# EAGLE design battery_display (EAGLE 7.3.0)
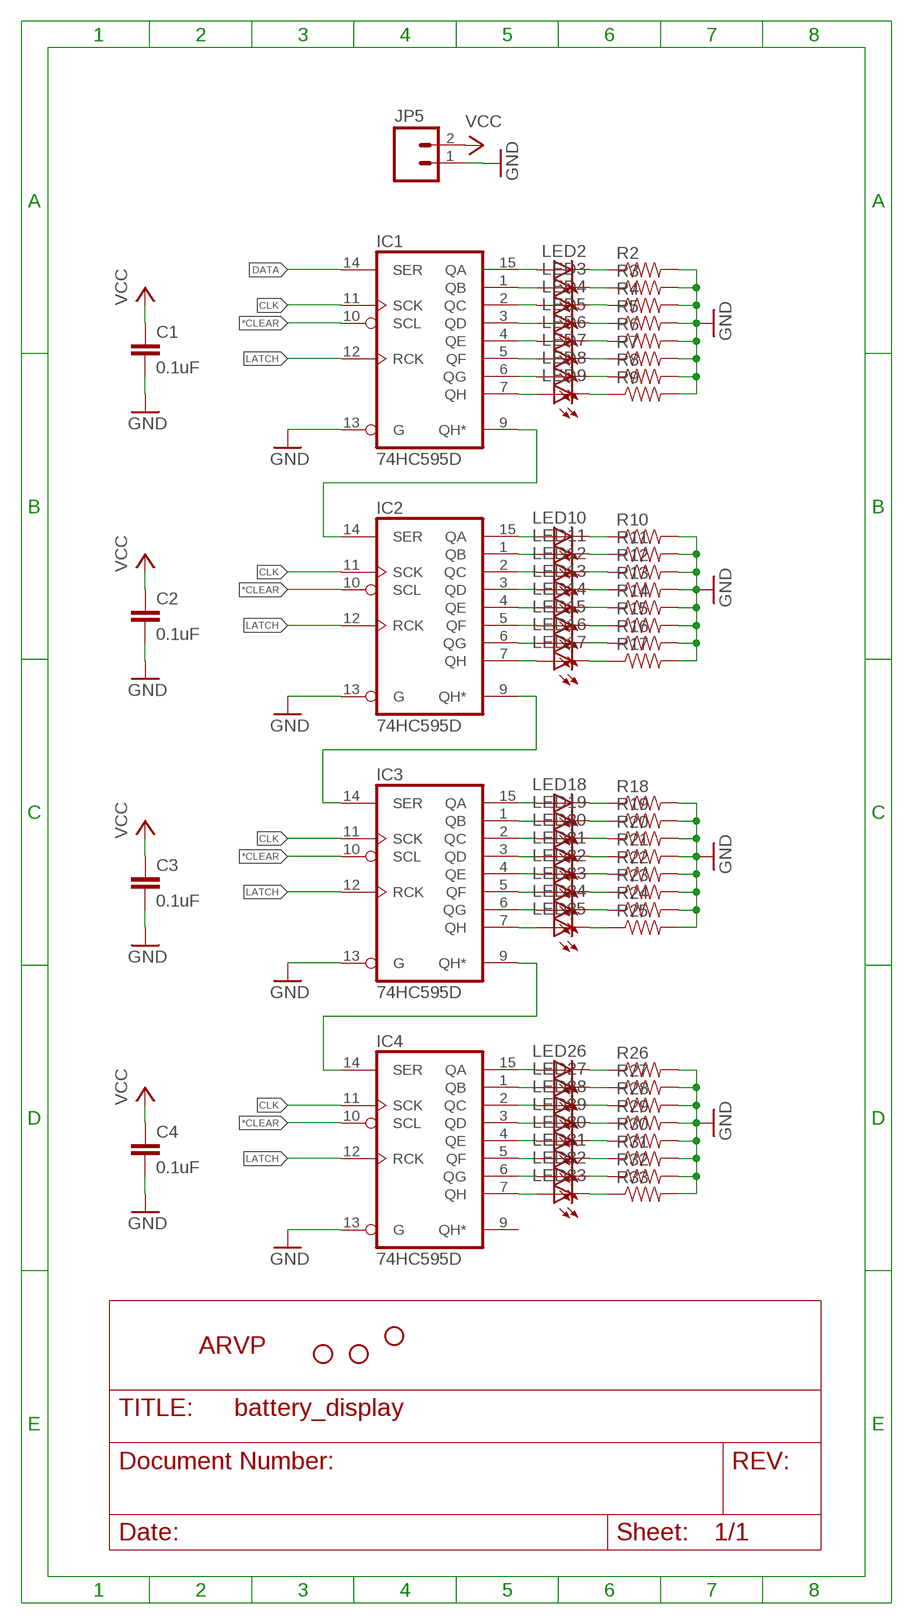
[diagram p0: schematic, sheet 1]

## Parts
C1  0.1uF  CAP1206  [1206]
C2  0.1uF  CAP1206  [1206]
C3  0.1uF  CAP1206  [1206]
C4  0.1uF  CAP1206  [1206]
IC1  74HC595D  [SO16]
IC2  74HC595D  [SO16]
IC3  74HC595D  [SO16]
IC4  74HC595D  [SO16]
JP2  STAND-OFF  [STAND-OFF]
JP3  STAND-OFF  [STAND-OFF]
JP4  STAND-OFF  [STAND-OFF]
JP5  M02POLAR_LOCK  [MOLEX-1X2_LOCK]
LED2  LED1206  [LED-1206]
LED3  LED1206  [LED-1206]
LED4  LED1206  [LED-1206]
LED5  LED1206  [LED-1206]
LED6  LED1206  [LED-1206]
LED7  LED1206  [LED-1206]
LED8  LED1206  [LED-1206]
LED9  LED1206  [LED-1206]
LED10  LED1206  [LED-1206]
LED11  LED1206  [LED-1206]
LED12  LED1206  [LED-1206]
LED13  LED1206  [LED-1206]
LED14  LED1206  [LED-1206]
LED15  LED1206  [LED-1206]
LED16  LED1206  [LED-1206]
LED17  LED1206  [LED-1206]
LED18  LED1206  [LED-1206]
LED19  LED1206  [LED-1206]
LED20  LED1206  [LED-1206]
LED21  LED1206  [LED-1206]
LED22  LED1206  [LED-1206]
LED23  LED1206  [LED-1206]
LED24  LED1206  [LED-1206]
LED25  LED1206  [LED-1206]
LED26  LED1206  [LED-1206]
LED27  LED1206  [LED-1206]
LED28  LED1206  [LED-1206]
LED29  LED1206  [LED-1206]
LED30  LED1206  [LED-1206]
LED31  LED1206  [LED-1206]
LED32  LED1206  [LED-1206]
LED33  LED1206  [LED-1206]
R2  RESISTOR1206  [1206]
R3  RESISTOR1206  [1206]
R4  RESISTOR1206  [1206]
R5  RESISTOR1206  [1206]
R6  RESISTOR1206  [1206]
R7  RESISTOR1206  [1206]
R8  RESISTOR1206  [1206]
R9  RESISTOR1206  [1206]
R10  RESISTOR1206  [1206]
R11  RESISTOR1206  [1206]
R12  RESISTOR1206  [1206]
R13  RESISTOR1206  [1206]
R14  RESISTOR1206  [1206]
R15  RESISTOR1206  [1206]
R16  RESISTOR1206  [1206]
R17  RESISTOR1206  [1206]
R18  RESISTOR1206  [1206]
R19  RESISTOR1206  [1206]
R20  RESISTOR1206  [1206]
R21  RESISTOR1206  [1206]
R22  RESISTOR1206  [1206]
R23  RESISTOR1206  [1206]
R24  RESISTOR1206  [1206]
R25  RESISTOR1206  [1206]
R26  RESISTOR1206  [1206]
R27  RESISTOR1206  [1206]
R28  RESISTOR1206  [1206]
R29  RESISTOR1206  [1206]
R30  RESISTOR1206  [1206]
R31  RESISTOR1206  [1206]
R32  RESISTOR1206  [1206]
R33  RESISTOR1206  [1206]
U$2  ARVP_LOGO  [ARVP]

## Nets
*CLEAR: IC1.10(SCL) IC2.10(SCL) IC3.10(SCL) IC4.10(SCL)
CLK: IC1.11(SCK) IC2.11(SCK) IC3.11(SCK) IC4.11(SCK)
DATA: IC1.14(SER)
GND: C1.2 C2.2 C3.2 C4.2 IC1.13(G) IC2.13(G) IC3.13(G) IC4.13(G) JP5.1 R2.2 R3.2 R4.2 R5.2 R6.2 R7.2 R8.2 R9.2 R10.2 R11.2 R12.2 R13.2 R14.2 R15.2 R16.2 R17.2 R18.2 R19.2 R20.2 R21.2 R22.2 R23.2 R24.2 R25.2 R26.2 R27.2 R28.2 R29.2 R30.2 R31.2 R32.2 R33.2
LATCH: IC1.12(RCK) IC2.12(RCK) IC3.12(RCK) IC4.12(RCK)
N$1: LED2.C R2.1
N$2: LED3.C R3.1
N$3: LED4.C R4.1
N$4: LED5.C R5.1
N$5: LED6.C R6.1
N$6: LED7.C R7.1
N$7: LED8.C R8.1
N$8: LED9.C R9.1
N$10: LED10.C R10.1
N$11: LED11.C R11.1
N$12: LED12.C R12.1
N$13: LED13.C R13.1
N$14: LED14.C R14.1
N$15: LED15.C R15.1
N$16: LED16.C R16.1
N$17: LED17.C R17.1
N$18: LED18.C R18.1
N$19: LED19.C R19.1
N$20: LED20.C R20.1
N$21: LED21.C R21.1
N$22: LED22.C R22.1
N$23: LED23.C R23.1
N$24: LED24.C R24.1
N$25: LED25.C R25.1
N$26: LED26.C R26.1
N$27: LED27.C R27.1
N$28: LED28.C R28.1
N$29: LED29.C R29.1
N$30: LED30.C R30.1
N$31: LED31.C R31.1
N$32: LED32.C R32.1
N$33: LED33.C R33.1
N$34: IC1.7(QH) LED9.A
N$35: IC1.6(QG) LED8.A
N$36: IC1.5(QF) LED7.A
N$37: IC1.4(QE) LED6.A
N$38: IC1.3(QD) LED5.A
N$39: IC1.2(QC) LED4.A
N$40: IC1.1(QB) LED3.A
N$41: IC1.15(QA) LED2.A
N$42: IC3.9(QH*) IC4.14(SER)
N$43: IC2.9(QH*) IC3.14(SER)
N$44: IC1.9(QH*) IC2.14(SER)
N$45: IC2.15(QA) LED10.A
N$46: IC2.2(QC) LED12.A
N$47: IC2.1(QB) LED11.A
N$48: IC2.3(QD) LED13.A
N$49: IC2.4(QE) LED14.A
N$50: IC2.5(QF) LED15.A
N$51: IC2.6(QG) LED16.A
N$52: IC2.7(QH) LED17.A
N$53: IC3.15(QA) LED18.A
N$54: IC3.1(QB) LED19.A
N$55: IC3.2(QC) LED20.A
N$56: IC3.3(QD) LED21.A
N$57: IC3.4(QE) LED22.A
N$58: IC3.5(QF) LED23.A
N$59: IC3.6(QG) LED24.A
N$60: IC3.7(QH) LED25.A
N$61: IC4.15(QA) LED26.A
N$62: IC4.1(QB) LED27.A
N$63: IC4.2(QC) LED28.A
N$64: IC4.3(QD) LED29.A
N$65: IC4.4(QE) LED30.A
N$66: IC4.5(QF) LED31.A
N$67: IC4.6(QG) LED32.A
N$68: IC4.7(QH) LED33.A
VCC: C1.1 C2.1 C3.1 C4.1 JP5.2
Unconnected: IC4.9(QH*)

## Power pins joined to a net without a drawn wire
GND: IC1.8(GND) IC2.8(GND) IC3.8(GND) IC4.8(GND)
VCC: IC1.16(VCC) IC2.16(VCC) IC3.16(VCC) IC4.16(VCC)

## Library data of the parts
C1-C4 = SparkFun:CAP: Capacitor Standard 0603 ceramic capacitor, and 0.1" leaded capacitor.
IC1-IC4 = 74xx-eu:74*595: 8-bit SHIFT REGISTER, output latch
JP2-JP4 = SparkFun:STAND-OFF: Stand Off This is the mechanical footprint for a #4 phillips button head screw. Use the keepout ring to avoid running the screw head into surrounding components. SKU : PRT-00447
JP5 = SparkFun:M02: Header 2 Standard 2-pin 0.1" header. Use with straight break away headers (SKU : PRT-00116), right angle break away headers (PRT-00553), swiss pins (PRT-00743), machine pins (PRT-00117), and female headers (PRT-00115). Molex polarized connector foot print use with SKU : PRT-08233 with associated crimp pins and housings.
LED2-LED33 = SparkFun:LED: LEDs Standard schematic elements and footprints for 5mm, 3mm, 1206, and 0603 sized LEDs. 5mm - Spark Fun Electronics SKU : COM-00529 (and others)
R2-R33 = SparkFun:RESISTOR: Resistor Basic schematic elements and footprints for 0603, 1206, and PTH resistors.
U$2 = ARVP:ARVP_LOGO

## Net classes
0 default: width 0.406 mm

## Board
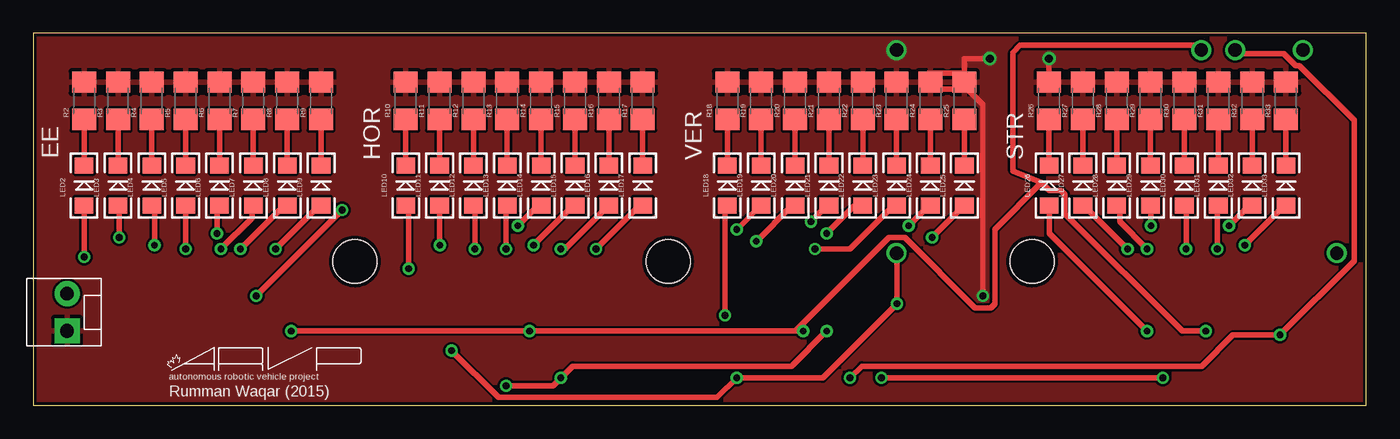
[diagram p1: board, top side]
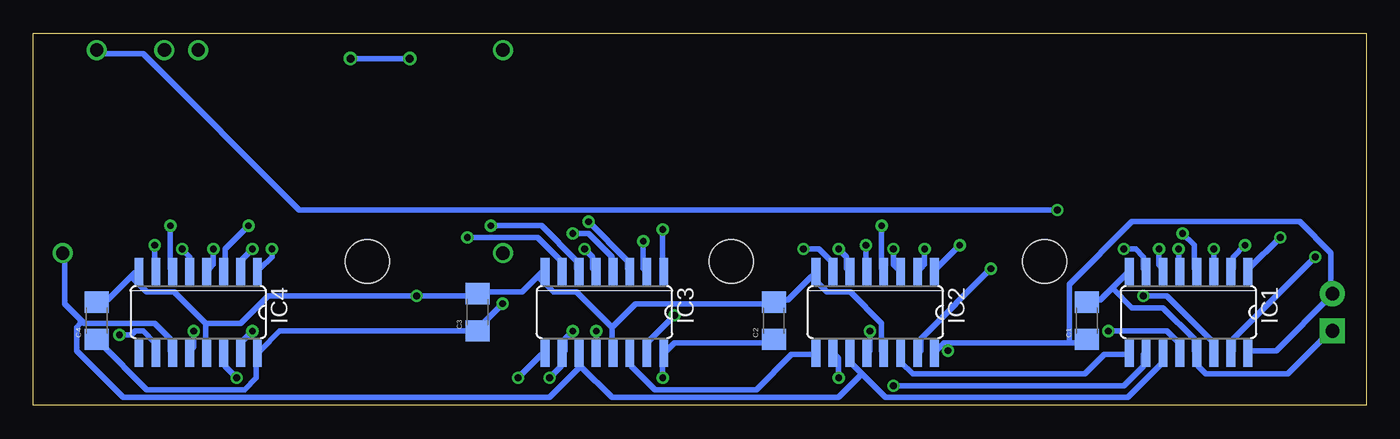
[diagram p2: board, bottom side, seen from below]

Size 100 x 27.93 mm. Coordinates in mm from the lower left corner, seen from the top.
Outline: 0,0 100,0 100,27.93 0,27.93 0,0
Copper layers (1*16): Top 0.035mm / dielectric 1.5mm / Bottom 0.035mm
Design rules "apcircuits": minimum track width 0.18mm, minimum drill 20mil, track to track 0.18mm, track to pad 0.18mm, pad to pad 0.18mm, via to via 0.18mm, smd to smd 0.18mm, copper to edge 0.25mm, drill to drill 0.25mm, minimum pad ring 10mil, minimum via ring 8mil, stop-mask expansion 4mil, vias tented up to drill 0mil, thermal gap 10mil

### Footprints (pad centres in the part's own frame; a part is rotated, then mirrored left to right if it is on the bottom)
1206 = smd 1.6 x 1.8: 1 -1.4,0; 2 1.4,0
SO16 = smd 0.66 x 2.032: 1 -4.445,-3.073; 2 -3.175,-3.073; 3 -1.905,-3.073; 4 -0.635,-3.073; 5 0.635,-3.073; 6 1.905,-3.073; 7 3.175,-3.073; 8 4.445,-3.073; 9 4.445,3.073; 10 3.175,3.073; 11 1.905,3.073; 12 0.635,3.073; 13 -0.635,3.073; 14 -1.905,3.073; 15 -3.175,3.073; 16 -4.445,3.073
STAND-OFF = hole 3.302: 0,0
MOLEX-1X2_LOCK = drill 1.016 pad 1.88 square: 1 -0.127,0 | drill 1.016 pad 1.88: 2 2.667,0
LED-1206 = smd 1.2 x 1.4: A -1.5,0; C 1.5,0

### Placement (x,y rotation side)
C1  20.95,6.35 90 bottom
C2  44.45,6.35 90 bottom
C3  66.67,6.99 90 bottom
C4  95.25,6.35 90 bottom
IC1  13.34,6.99 180 bottom
IC2  36.83,6.99 180 bottom
IC3  57.15,6.99 180 bottom
IC4  87.63,6.99 180 bottom
JP2  47.62,10.79 0 top
JP3  24.13,10.79 0 top
JP4  74.93,10.79 0 top
JP5  2.54,5.71 90 top
LED2  3.81,16.51 90 top
LED3  6.35,16.51 90 top
LED4  8.89,16.51 90 top
LED5  11.43,16.51 90 top
LED6  13.97,16.51 90 top
LED7  16.51,16.51 90 top
LED8  19.05,16.51 90 top
LED9  21.59,16.51 90 top
LED10  27.94,16.51 90 top
LED11  30.48,16.51 90 top
LED12  33.02,16.51 90 top
LED13  35.56,16.51 90 top
LED14  38.1,16.51 90 top
LED15  40.64,16.51 90 top
LED16  43.18,16.51 90 top
LED17  45.72,16.51 90 top
LED18  52.07,16.51 90 top
LED19  54.61,16.51 90 top
LED20  57.15,16.51 90 top
LED21  59.69,16.51 90 top
LED22  62.23,16.51 90 top
LED23  64.77,16.51 90 top
LED24  67.31,16.51 90 top
LED25  69.85,16.51 90 top
LED26  76.2,16.51 90 top
LED27  78.74,16.51 90 top
LED28  81.28,16.51 90 top
LED29  83.82,16.51 90 top
LED30  86.36,16.51 90 top
LED31  88.9,16.51 90 top
LED32  91.44,16.51 90 top
LED33  93.98,16.51 90 top
R2  3.81,22.86 90 top
R3  6.35,22.86 90 top
R4  8.89,22.86 90 top
R5  11.43,22.86 90 top
R6  13.97,22.86 90 top
R7  16.51,22.86 90 top
R8  19.05,22.86 90 top
R9  21.59,22.86 90 top
R10  27.94,22.86 90 top
R11  30.48,22.86 90 top
R12  33.02,22.86 90 top
R13  35.56,22.86 90 top
R14  38.1,22.86 90 top
R15  40.64,22.86 90 top
R16  43.18,22.86 90 top
R17  45.72,22.86 90 top
R18  52.07,22.86 90 top
R19  54.61,22.86 90 top
R20  57.15,22.86 90 top
R21  59.69,22.86 90 top
R22  62.23,22.86 90 top
R23  64.77,22.86 90 top
R24  67.31,22.86 90 top
R25  69.85,22.86 90 top
R26  76.2,22.86 90 top
R27  78.74,22.86 90 top
R28  81.28,22.86 90 top
R29  83.82,22.86 90 top
R30  86.36,22.86 90 top
R31  88.9,22.86 90 top
R32  91.44,22.86 90 top
R33  93.98,22.86 90 top
U$2  10.16,1.91 0 top

### Tracks (layer width: path | path; a pad name or v marks a point on that pad's centre or on a via)
*CLEAR  (via drill 0.51, 1)
  Top 0.406: v90.17,26.67 90.31,26.39 93.82,26.39 94.7,25.51 95,25.51 99.1,21.4 99.1,10.85 v93.53,5.28 90.01,5.28 87.67,2.93 62.16,2.93 v61.28,2.05 | v35.48,1.47 39,1.47 v39.58,2.05 40.46,2.93 56.88,2.93 v59.52,5.57
  Bottom 0.406: v93.53,5.28 92.65,5.28 92.36,5.57 91.77,5.57 90.89,4.69 90.89,4.11 IC4.10 | v35.48,1.47 18.18,1.47 16.71,2.93 16.71,3.81 IC1.10 | v39.58,2.05 39.58,3.52 39.88,3.81 IC2.10 | v59.52,5.57 60.11,4.98 60.11,4.11 IC3.10 60.4,3.81 60.4,2.93 v61.28,2.05
CLK  (via drill 1)
  Bottom 0.406: 96.46,6.45 96.17,6.16 90.89,6.16 89.72,4.98 89.72,4.11 IC4.11 | 96.46,6.45 97.64,7.62 97.64,11.14 v97.79,11.43 | 37.82,2.35 38.7,3.23 38.7,3.81 IC2.11 | 37.82,2.35 36.06,0.59 17.89,0.59 15.25,3.23 15.25,3.81 IC1.11 | 58.93,2.93 58.93,3.81 IC3.11 58.93,2.93 | 58.93,2.93 56.59,0.59 39.58,0.59 37.82,2.35 | 96.46,6.45 96.46,6.16 96.76,5.86 96.76,4.11 93.24,0.59 61.28,0.59 58.93,2.93
DATA  (via drill 0.51, 1)
  Top 0.406: v16.71,8.21 v23.16,14.66
  Bottom 0.406: v23.16,14.66 80.04,14.66 91.77,26.39 95,26.39 v95.25,26.67 | v16.71,8.21 14.95,8.21 11.44,4.69 11.44,4.11 IC1.14
GND  (via drill 0.51, 0.6, 1)
  Top 0.406: v71.25,8.21 71.25,22.58 70.08,23.75 67.14,23.75 66.85,24.04 66.85,24.34 67.14,24.63 67.14,24.92 69.78,24.92 70.08,24.63 70.08,24.34 R25.2 69.85,26.04 v71.75,26.04 | R26.2 v76.2,26.04
  Bottom 0.406: 19.06,8.8 17.89,9.97 IC1.8 | 19.06,8.8 19.94,7.92 20.82,7.92 C1.2 | 19.06,8.8 17.59,7.33 15.25,7.33 12.9,4.98 12.9,4.11 IC1.13 12.61,3.81 12.61,2.93 12.02,2.35 5.86,2.35 2.64,5.57 JP5.1 | 92.65,9.68 92.36,9.97 IC4.8 | 92.65,9.68 94.41,7.92 95,7.92 C4.2 | 87.08,6.16 87.08,4.11 IC4.13 | 87.08,6.16 89.43,8.5 91.48,8.5 92.65,9.68 | 41.63,9.68 41.34,9.97 IC2.8 | 41.63,9.68 43.39,7.92 44.27,7.92 C2.2 44.57,7.62 54.83,7.62 56.59,5.86 | 41.63,9.68 40.46,8.5 38.7,8.5 36.36,6.16 36.36,4.11 IC2.13 | 62.16,9.68 61.87,9.97 IC3.8 | 62.16,9.68 63.33,8.5 66.56,8.5 C3.2 66.85,8.21 v71.25,8.21 82.39,8.21 84.44,6.16 87.08,6.16 | 56.59,5.86 56.59,4.11 IC3.13 | 56.59,5.86 59.23,8.5 60.99,8.5 62.16,9.68 | v76.2,26.04 v71.75,26.04
  other vias: 64.77,26.67
  pour Top: 0,29.21 100.33,29.21 100.33,0 0,0
LATCH  (via drill 0.51, 1)
  Top 0.406: 75.65,16.71 76.23,16.13 77.11,16.13 77.41,15.83 77.41,14.37 86.2,5.57 v87.96,5.57 | 75.65,16.71 73.5,17.59 73.5,26.48 74.03,27.02 87.37,27.02 v87.63,26.67 | v19.35,5.57 v37.24,5.57 57.17,5.57 | 57.17,5.57 v57.76,5.57 | 75.65,16.71 72.13,13.19 72.13,7.62 71.83,7.33 70.66,7.33 65.38,12.61 64.21,12.61 57.17,5.57
  Bottom 0.406: v87.96,5.57 87.96,4.4 88.25,4.11 IC4.12 | v19.35,5.57 14.95,5.57 14.07,4.69 14.07,4.11 IC1.12 | v37.24,5.57 37.24,4.11 IC2.12 | v57.76,5.57 57.76,4.11 IC3.12
N$1
  Top 0.406: LED2.C R2.1
N$2
  Top 0.406: LED3.C R3.1
N$3
  Top 0.406: LED4.C R4.1
N$4
  Top 0.406: LED5.C R5.1
N$5
  Top 0.406: LED6.C R6.1
N$6
  Top 0.406: R7.1 LED7.C
N$7
  Top 0.406: LED8.C R8.1
N$8
  Top 0.406: LED9.C R9.1
N$10
  Top 0.406: LED10.C R10.1
N$11
  Top 0.406: LED11.C R11.1
N$12
  Top 0.406: R12.1 LED12.C
N$13
  Top 0.406: R13.1 LED13.C
N$14
  Top 0.406: LED14.C R14.1
N$15
  Top 0.406: LED15.C R15.1
N$16
  Top 0.406: R16.1 LED16.C
N$17
  Top 0.406: R17.1 LED17.C
N$18
  Top 0.406: LED18.C R18.1
N$19
  Top 0.406: R19.1 LED19.C
N$20
  Top 0.406: LED20.C R20.1
N$21
  Top 0.406: R21.1 LED21.C
N$22
  Top 0.406: R22.1 LED22.C
N$23
  Top 0.406: R23.1 LED23.C
N$24
  Top 0.406: LED24.C R24.1
N$25
  Top 0.406: R25.1 LED25.C
N$26
  Top 0.406: LED26.C R26.1
N$27
  Top 0.406: R27.1 LED27.C
N$28
  Top 0.406: LED28.C R28.1
N$29
  Top 0.406: R29.1 LED29.C
N$30
  Top 0.406: LED30.C R30.1
N$31
  Top 0.406: R31.1 LED31.C
N$32
  Top 0.406: R32.1 LED32.C
N$33
  Top 0.406: R33.1 LED33.C
N$34  (via drill 0.51)
  Top 0.406: v18.18,11.73 21.4,14.95 LED9.A
  Bottom 0.406: v18.18,11.73 17.3,11.73 16.71,11.14 16.71,10.26 IC1.7
N$35  (via drill 0.51)
  Top 0.406: v15.54,11.73 18.77,14.95 LED8.A
  Bottom 0.406: v15.54,11.73 15.54,10.55 15.25,10.26 IC1.6
N$36  (via drill 0.51)
  Top 0.406: v14.07,11.73 16.42,14.07 16.42,14.95 LED7.A
  Bottom 0.406: v14.07,11.73 14.07,10.26 IC1.5
N$37  (via drill 0.51)
  Top 0.406: v13.78,12.9 13.78,14.95 LED6.A
  Bottom 0.406: v13.78,12.9 12.9,12.02 12.9,10.26 IC1.4
N$38  (via drill 0.51)
  Top 0.406: v11.44,11.73 11.44,14.95 LED5.A
  Bottom 0.406: v11.44,11.73 11.44,10.26 IC1.3
N$39  (via drill 0.51)
  Top 0.406: v9.09,12.02 9.09,14.95 LED4.A
  Bottom 0.406: v9.09,12.02 9.97,11.14 9.97,10.26 IC1.2
N$40  (via drill 0.51)
  Top 0.406: v6.45,12.61 6.45,14.95 LED3.A
  Bottom 0.406: v6.45,12.61 8.8,10.26 IC1.1
N$41  (via drill 0.51)
  Top 0.406: v3.81,11.14 3.81,14.95 LED2.A
  Bottom 0.406: v3.81,11.14 9.97,4.98 9.97,4.11 IC1.15
N$42  (via drill 0.51)
  Top 0.406: v84.73,2.05 v63.62,2.05
  Bottom 0.406: v63.62,2.05 61.87,3.81 IC3.9 | v84.73,2.05 85.61,2.93 85.61,3.81 IC4.14
N$43
  Bottom 0.406: IC2.9 41.34,3.81 43.1,3.81 45.74,1.17 53.36,1.17 55.12,2.93 55.12,3.81 IC3.14
N$44
  Bottom 0.406: IC1.9 17.89,3.81 19.64,3.81 21.11,2.35 34.01,2.35 34.89,3.23 34.89,3.81 IC2.14
N$45  (via drill 0.51)
  Top 0.406: v28.15,10.26 28.15,14.95 LED10.A
  Bottom 0.406: v28.15,10.26 33.42,4.98 33.42,4.11 IC2.15
N$46  (via drill 0.51)
  Top 0.406: v33.13,11.73 33.13,14.95 LED12.A
  Bottom 0.406: v33.13,11.73 33.13,10.55 33.42,10.26 IC2.2
N$47  (via drill 0.51)
  Top 0.406: v30.49,12.02 30.49,14.95 LED11.A
  Bottom 0.406: v30.49,12.02 32.25,10.26 IC2.1
N$48  (via drill 0.51)
  Top 0.406: v35.48,11.73 35.48,14.95 LED13.A
  Bottom 0.406: v35.48,11.73 35.48,10.55 35.18,10.26 IC2.3
N$49  (via drill 0.51)
  Top 0.406: v36.36,13.49 37.82,14.95 LED14.A
  Bottom 0.406: v36.36,13.49 36.36,10.26 IC2.4
N$50  (via drill 0.51)
  Top 0.406: v37.53,12.02 40.46,14.95 LED15.A
  Bottom 0.406: v37.53,12.02 37.53,10.26 IC2.5
N$51  (via drill 0.51)
  Top 0.406: v39.58,11.73 39.88,11.73 43.1,14.95 LED16.A
  Bottom 0.406: v39.58,11.73 39,11.14 39,10.26 IC2.6
N$52  (via drill 0.51)
  Top 0.406: v42.22,11.73 45.45,14.95 LED17.A
  Bottom 0.406: v42.22,11.73 41.05,11.73 40.17,10.85 40.17,10.26 IC2.7
N$53  (via drill 0.51)
  Top 0.406: v51.9,6.74 51.9,14.95 LED18.A
  Bottom 0.406: v51.9,6.74 53.95,4.69 53.95,4.11 IC3.15
N$54  (via drill 0.51)
  Top 0.406: v52.78,13.19 54.53,14.95 LED19.A
  Bottom 0.406: v52.78,13.19 52.78,10.26 IC3.1
N$55  (via drill 0.51)
  Top 0.406: v54.24,12.31 56.88,14.95 LED20.A
  Bottom 0.406: v54.24,12.31 54.24,10.26 IC3.2
N$56  (via drill 0.51)
  Top 0.406: v58.35,13.78 59.52,14.95 LED21.A
  Bottom 0.406: v58.35,13.78 55.41,10.85 55.41,10.26 IC3.3
N$57  (via drill 0.51)
  Top 0.406: v59.52,12.9 61.57,14.95 62.16,14.95 LED22.A
  Bottom 0.406: v59.52,12.9 58.35,12.9 56.59,11.14 56.59,10.26 IC3.4
N$58  (via drill 0.51)
  Top 0.406: v58.64,11.73 61.28,11.73 64.5,14.95 LED23.A
  Bottom 0.406: v58.64,11.73 58.05,11.14 58.05,10.26 IC3.5
N$59  (via drill 0.51)
  Top 0.406: v65.68,13.49 67.14,14.95 LED24.A
  Bottom 0.406: v65.68,13.49 61.87,13.49 59.23,10.85 59.23,10.26 IC3.6
N$60  (via drill 0.51)
  Top 0.406: v67.44,12.61 69.78,14.95 LED25.A
  Bottom 0.406: v67.44,12.61 62.16,12.61 60.4,10.85 60.4,10.26 IC3.7
N$61  (via drill 0.51)
  Top 0.406: v83.56,5.57 76.23,12.9 76.23,14.95 LED26.A
  Bottom 0.406: v83.56,5.57 84.44,4.69 84.44,4.11 IC4.15
N$62  (via drill 0.51)
  Top 0.406: v82.1,11.73 78.87,14.95 LED27.A
  Bottom 0.406: v82.1,11.73 82.1,11.14 82.98,10.26 IC4.1
N$63  (via drill 0.51)
  Top 0.406: v83.56,11.73 81.51,13.78 81.51,14.95 LED28.A
  Bottom 0.406: v83.56,11.73 84.44,10.85 84.44,10.26 IC4.2
N$64  (via drill 0.51)
  Top 0.406: v83.86,13.49 83.86,14.95 LED29.A
  Bottom 0.406: v83.86,13.49 85.61,11.73 85.61,10.26 IC4.3
N$65  (via drill 0.51)
  Top 0.406: v86.49,11.73 86.49,14.95 LED30.A
  Bottom 0.406: v86.49,11.73 86.49,10.55 86.79,10.26 IC4.4
N$66  (via drill 0.51)
  Top 0.406: v88.84,11.73 88.84,14.95 LED31.A
  Bottom 0.406: v88.84,11.73 88.25,11.14 88.25,10.26 IC4.5
N$67  (via drill 0.51)
  Top 0.406: v89.72,13.49 91.19,14.95 LED32.A
  Bottom 0.406: v89.72,13.49 89.72,10.26 IC4.6
N$68  (via drill 0.51)
  Top 0.406: v90.89,12.02 93.82,14.95 LED33.A
  Bottom 0.406: v90.89,12.02 90.89,10.26 IC4.7
VCC  (via drill 0.51, 1)
  Top 0.406: v64.77,11.43 64.8,11.14 v64.8,7.62 59.23,2.05 v52.78,2.05 51.31,0.59 34.89,0.59 v31.37,4.11
  Bottom 0.406: 31.37,4.69 31.67,4.69 32.25,4.11 IC2.16 | 31.37,4.69 22.28,4.69 | 22.28,4.69 21.11,4.69 C1.1 | IC1.16 8.8,4.11 6.74,4.11 2.64,8.21 JP5.2 2.64,8.5 2.64,11.44 4.98,13.78 17.59,13.78 22.28,9.09 22.28,4.69 | C2.1 44.57,4.69 51.9,4.69 52.48,4.11 IC3.16 52.78,3.81 v52.78,2.05 | v64.8,7.62 66.56,5.86 C3.1 66.85,5.57 81.51,5.57 82.98,4.11 IC4.16 83.27,3.81 83.27,2.05 84.15,1.17 91.48,1.17 95,4.69 C4.1 | v31.37,4.11 31.37,4.69

### Text on the board
tPlace: EE | HOR | VER | STR | Rumman Waqar (2015)